# EAGLE design gpi-ctl (EAGLE 7.5.0)
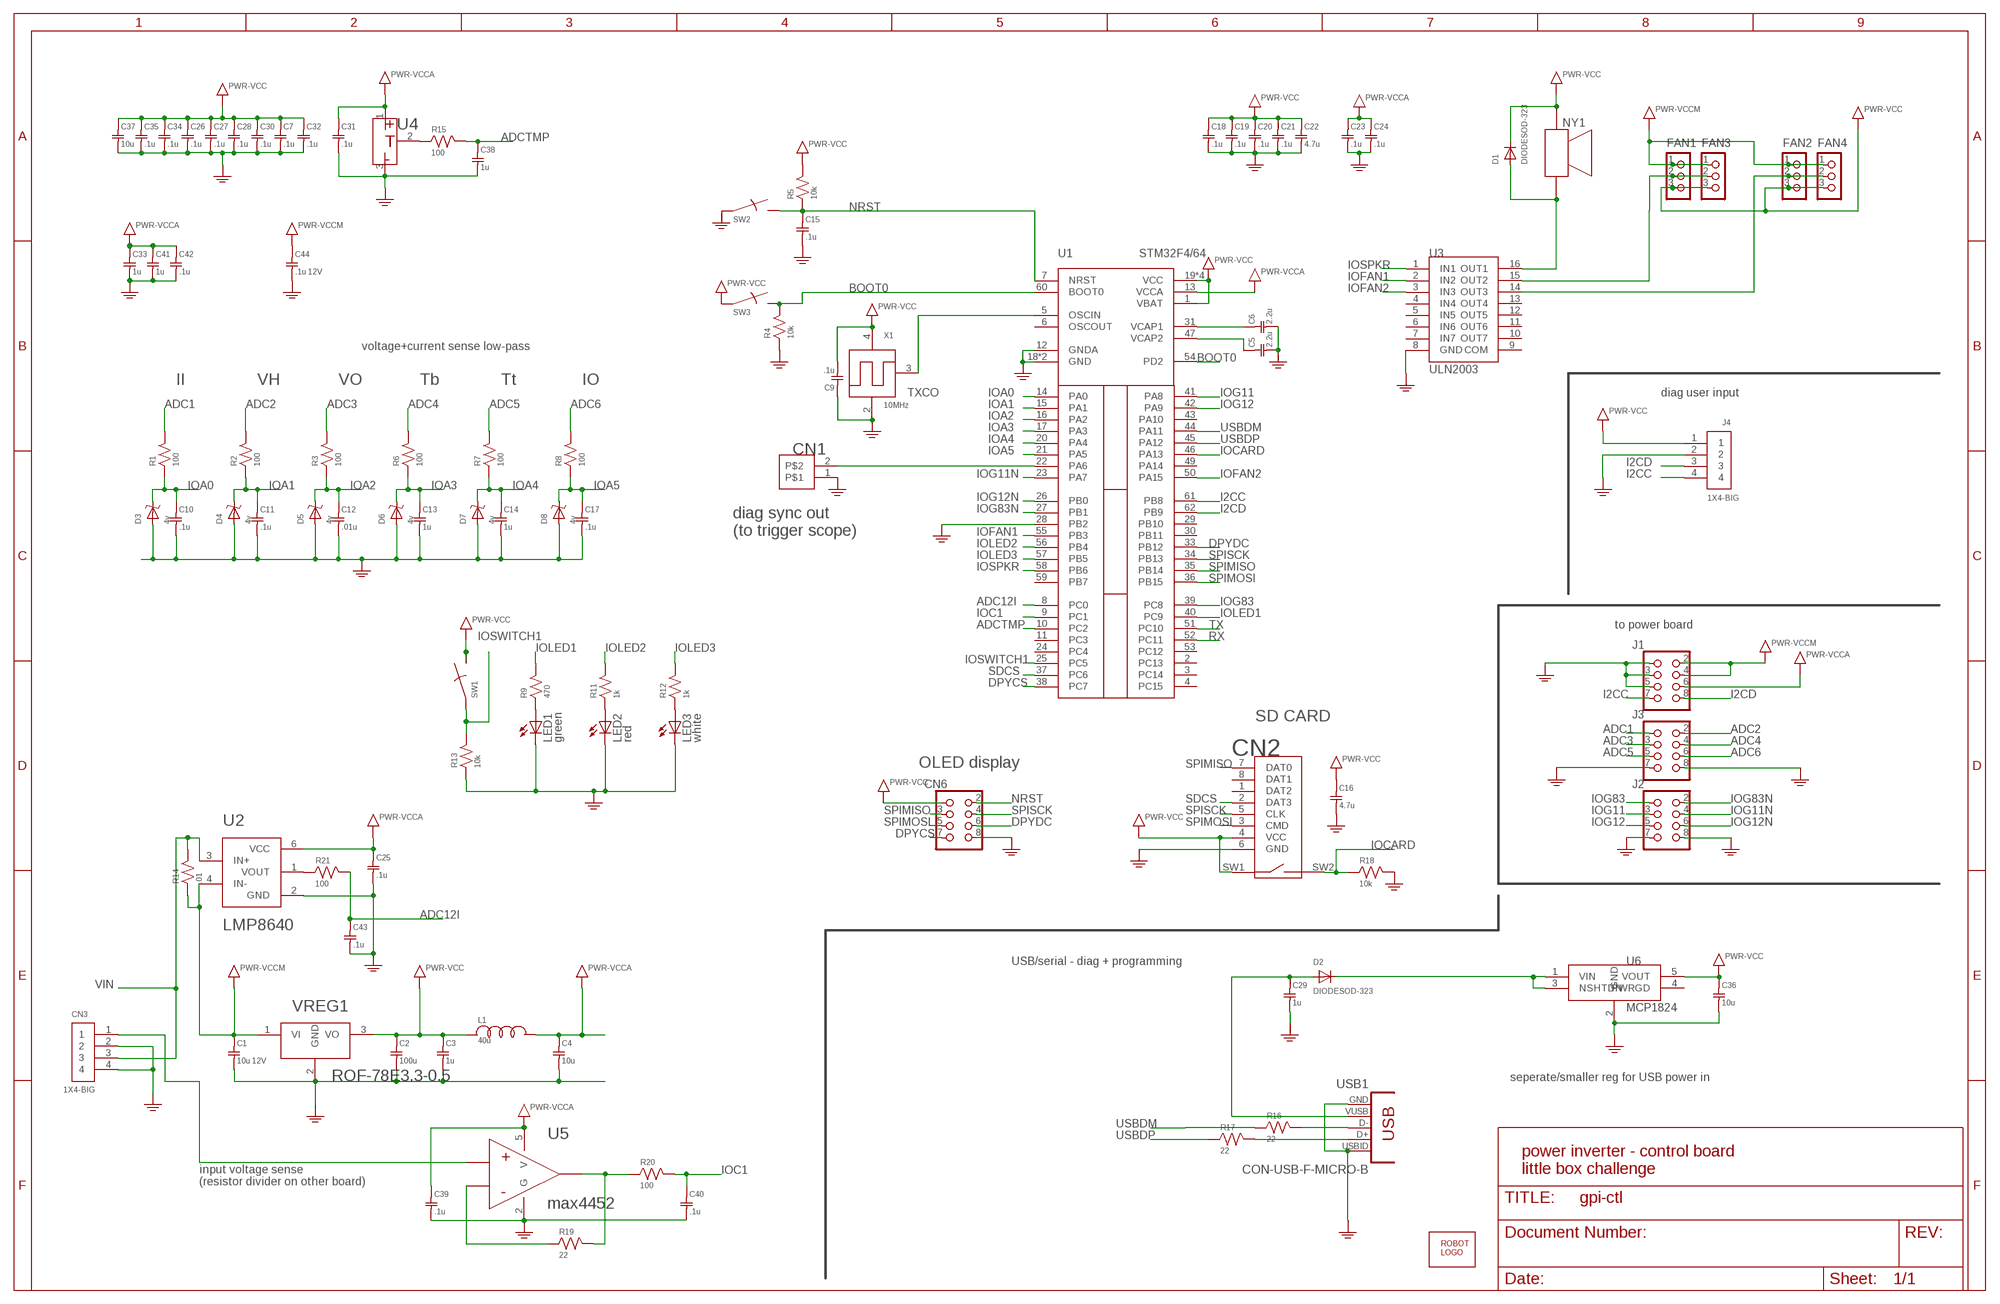
[diagram p0: schematic, sheet 1]

## Parts
C1  10u 12V  C0603  [SMD0603]
C2  100u  C1210  [SMD1210]
C3  1u  C0603  [SMD0603]
C4  10u  C0603  [SMD0603]
C5  2.2u  C0603  [SMD0603]
C6  2.2u  C0603  [SMD0603]
C7  .1u  C0603  [SMD0603]
C9  .1u  C0603  [SMD0603]
C10  .1u  C0603  [SMD0603]
C11  .1u  C0603  [SMD0603]
C12  .01u  C0603  [SMD0603]
C13  1u  C0603  [SMD0603]
C14  1u  C0603  [SMD0603]
C15  .1u  C0603  [SMD0603]
C16  4.7u  C0603  [SMD0603]
C17  .1u  C0603  [SMD0603]
C18  .1u  C0603  [SMD0603]
C19  .1u  C0603  [SMD0603]
C20  .1u  C0603  [SMD0603]
C21  .1u  C0603  [SMD0603]
C22  4.7u  C0603  [SMD0603]
C23  .1u  C0603  [SMD0603]
C24  .1u  C0603  [SMD0603]
C25  .1u  C0603  [SMD0603]
C26  .1u  C0603  [SMD0603]
C27  .1u  C0603  [SMD0603]
C28  .1u  C0603  [SMD0603]
C29  1u  C0603  [SMD0603]
C30  .1u  C0603  [SMD0603]
C31  .1u  C0603  [SMD0603]
C32  .1u  C0603  [SMD0603]
C33  1u  C0603  [SMD0603]
C34  .1u  C0603  [SMD0603]
C35  .1u  C0603  [SMD0603]
C36  10u  C0603  [SMD0603]
C37  10u  C0603  [SMD0603]
C38  1u  C0603  [SMD0603]
C39  .1u  C0603  [SMD0603]
C40  .1u  C0603  [SMD0603]
C41  1u  C0603  [SMD0603]
C42  .1u  C0603  [SMD0603]
C43  .1u  C0603  [SMD0603]
C44  .1u 12V  C0603  [SMD0603]
CN1  HEADER-1X2.4  [HEADER-1X2-THM-WIDE]
CN2  MICROSDPLAIN  [MICROSD/MOLEX/FRONT/PLAIN]
CN3  1X4-BIG  [1X04-BIG]
CN6  HEADER-2X4  [HEADER-2X04]
D1  DIODESOD-323  [SOD-323]
D2  DIODESOD-323  [SOD-323]
D3  4v  ZENER  [SOD-323]
D4  4v  ZENER  [SOD-323]
D5  4v  ZENER  [SOD-323]
D6  4v  ZENER  [SOD-323]
D7  4v  ZENER  [SOD-323]
D8  4v  ZENER  [SOD-323]
FAN1  CON_HEADER_1X03-PTH  [M1X3]
FAN2  CON_HEADER_1X03-PTH  [M1X3]
FAN3  CON_HEADER_1X03-PTH  [M1X3]
FAN4  CON_HEADER_1X03-PTH  [M1X3]
J1  HEADER-2X4  [HEADER-2X04]
J2  HEADER-2X4  [HEADER-2X04]
J3  HEADER-2X4  [HEADER-2X04]
J4  1X4-BIG  [1X04-BIG]
L1  40u  LSMD0603  [SMD0603]
LED1  green  LED3MM  [LED3MM]
LED2  red  LED3MM  [LED3MM]
LED3  white  LED3MM  [LED3MM]
NY1  PUI-5040  [PUI-0540]
R1  100  R0603  [SMD0603]
R2  100  R0603  [SMD0603]
R3  100  R0603  [SMD0603]
R4  10k  R0603  [SMD0603]
R5  10k  R0603  [SMD0603]
R6  100  R0603  [SMD0603]
R7  100  R0603  [SMD0603]
R8  100  R0603  [SMD0603]
R9  470  R0603  [SMD0603]
R11  1k  R0603  [SMD0603]
R12  1k  R0603  [SMD0603]
R13  10k  R0603  [SMD0603]
R14  .01  R0805  [SMD0805]
R15  100  R0603  [SMD0603]
R16  22  R0603  [SMD0603]
R17  22  R0603  [SMD0603]
R18  10k  R0603  [SMD0603]
R19  22  R0603  [SMD0603]
R20  100  R0603  [SMD0603]
R21  100  R0603  [SMD0603]
SW1  SWITCHGT12-THOLE  [SWITCH-GT12MCBE]
SW2  SWITCHKMR211  [KMR211]
SW3  SWITCHKMR211  [KMR211]
U1  STM32F4/64  [TQFP64]
U2  LMP8640  [SOT-6]
U3  ULN2003  [TSSOP-16]
U4  TEMPERATURE  [SOT-23]
U5  max4452  OPAMP  [SOT-23-5]
U6  MCP1824  [SOT-23-5]
U$1  ROBOTMAN-LOGO  [ROBOTMAN-LOGO]
USB1  CON-USB-F-MICRO-B  [CONN_USB_MICRO-B]
VREG1  ROF-78E3.3-0.5  REGULATORROF  [ROF7800]
X1  10MHz  OSC  [OSC-AST3TQ]

## Nets
ADC1: J3.1 R1.2
ADC2: J3.2 R2.2
ADC3: J3.3 R3.2
ADC4: J3.4 R6.2
ADC5: J3.5 R7.2
ADC6: J3.6 R8.2
ADC12I: C43.1 R21.2 U1.8(PC0)
ADCTMP: C38.1 R15.2 U1.10(PC2)
BOOT0: R4.2 SW3.2 SW3.4 U1.54(PD2) U1.60(BOOT0)
DPYCS: CN6.7 U1.38(PC7)
DPYDC: CN6.6 U1.33(PB12)
GND: C1.2 C2.2 C3.2 C4.2 C5.2 C6.2 C7.2 C9.1 C10.2 C11.2 C12.2 C13.2 C14.2 C15.2 C16.2 C17.2 C18.2 C19.2 C20.2 C21.2 C22.2 C23.2 C24.2 C25.2 C26.2 C27.2 C28.2 C29.2 C30.2 C31.2 C32.2 C33.2 C34.2 C35.2 C36.2 C37.2 C38.2 C39.2 C40.2 C41.2 C42.2 C43.2 C44.2 CN1.1 CN2.6(GND) CN3.2 CN3.4 CN6.8 D3.A D4.A D5.A D6.A D7.A D8.A J1.1 J1.3 J1.5 J2.7 J2.8 J3.7 J3.8 J4.2 LED1.K(C) LED2.K(C) LED3.K(C) R4.1 R13.1 R18.2 SW2.1 SW2.3 U1.12(GNDA) U1.18(GND) U1.28(PB2) U1.63(GND) U2.2(GND) U3.8(GND) U4.3(G) U5.2(G) U6.2(GND) USB1.P4(USBID) USB1.P5(GND) VREG1.2(GND) X1.2(GND) ; supply symbol labelled PWR-GND
I2CC: J1.7 J4.4 U1.61(PB8)
I2CD: J1.8 J4.3 U1.62(PB9)
IOA0: C10.1 D3.C R1.1 U1.14(PA0)
IOA1: C11.1 D4.C R2.1 U1.15(PA1)
IOA2: C12.1 D5.C R3.1 U1.16(PA2)
IOA3: C13.1 D6.C R6.1 U1.17(PA3)
IOA4: C14.1 D7.C R7.1 U1.20(PA4)
IOA5: C17.1 D8.C R8.1 U1.21(PA5)
IOC1: C40.1 R20.2 U1.9(PC1)
IOCARD: CN2.SW2 R18.1 U1.46(PA13)
IOFAN1: U1.55(PB3) U3.2(IN2)
IOFAN2: U1.50(PA15) U3.3(IN3)
IOG11: J2.3 U1.41(PA8)
IOG11N: J2.4 U1.23(PA7)
IOG12: J2.5 U1.42(PA9)
IOG12N: J2.6 U1.26(PB0)
IOG83: J2.1 U1.39(PC8)
IOG83N: J2.2 U1.27(PB1)
IOLED1: R9.2 U1.40(PC9)
IOLED2: R11.2 U1.56(PB4)
IOLED3: R12.2 U1.57(PB5)
IOSPKR: U1.58(PB6) U3.1(IN1)
IOSWITCH1: R13.2 SW1.1 U1.25(PC5)
N$1: FAN2.2 FAN4.2 U3.14(OUT3)
N$2: R17.2 USB1.P3(D+)
N$3: U1.5(OSCIN) X1.3(OSC)
N$4: R16.2 USB1.P2(D-)
N$6: FAN1.2 FAN3.2 U3.15(OUT2)
N$8: D2.C U6.1(VIN) U6.3(NSHTDN)
N$9: R15.1 U4.2(OUT)
N$10: R19.1 U5.4(INM)
N$11: R19.2 R20.1 U5.1(OUT)
N$12: CN1.2 U1.22(PA6)
N$13: CN3.1 U5.3(INP)
N$15: LED1.A R9.1
N$16: LED2.A R11.1
N$17: LED3.A R12.1
N$18: R21.1 U2.1(VOUT)
N$29: C6.1 U1.31(VCAP1)
N$39: C5.1 U1.47(VCAP2)
NRST: C15.1 CN6.2 R5.1 SW2.2 SW2.4 U1.7(NRST)
RX: U1.52(PC11)
SDCS: CN2.2(DAT3) U1.37(PC6)
SPIMISO: CN2.7(DAT0) CN6.3 U1.35(PB14)
SPIMOSI: CN2.3(CMD) CN6.5 U1.36(PB15)
SPISCK: CN2.5(CLK) CN6.4 U1.34(PB13)
SPKR: D1.A NY1.P2 U3.16(OUT1)
TX: U1.51(PC10)
USBDM: R16.1 U1.44(PA11)
USBDP: R17.1 U1.45(PA12)
VBUS: C29.1 D2.A USB1.P1(VUSB)
VCC: C2.1 C3.1 C7.1 C9.2 C16.1 C18.1 C19.1 C20.1 C21.1 C22.1 C26.1 C27.1 C28.1 C30.1 C32.1 C34.1 C35.1 C36.1 C37.1 CN2.4(VCC) CN2.SW1 CN6.1 D1.C FAN1.3 FAN2.3 FAN3.3 FAN4.3 J4.1 L1.1 NY1.P1 R5.2 SW1.3 SW3.1 SW3.3 U1.1(VBAT) U1.19(VCC) U1.32(VCC) U1.48(VCC) U1.64(VCC) U6.5(VOUT) VREG1.3(VO) X1.4(VCC) ; supply symbol labelled PWR-VCC
VCCA: C4.1 C23.1 C24.1 C25.1 C31.1 C33.1 C39.1 C41.1 C42.1 J1.6 L1.2 U1.13(VCCA) U2.6(VCC) U4.1(V) U5.5(V) ; supply symbol labelled PWR-VCCA
VCCM: C1.1 C44.1 FAN1.1 FAN2.1 FAN3.1 FAN4.1 J1.2 J1.4 R14.1 U2.4(IN-) VREG1.1(VI) ; supply symbol labelled PWR-VCCM
VIN: CN3.3 R14.2 U2.3(IN+)
Unconnected: CN2.1(DAT2) CN2.8(DAT1) U1.2(PC13) U1.3(PC14) U1.4(PC15) U1.6(OSCOUT) U1.11(PC3) U1.24(PC4) U1.29(PB10) U1.30(PB11) U1.43(PA10) U1.49(PA14) U1.53(PC12) U1.59(PB7) U3.4(IN4) U3.5(IN5) U3.6(IN6) U3.7(IN7) U3.9(COM) U3.10(OUT7) U3.11(OUT6) U3.12(OUT5) U3.13(OUT4) U6.4(PWRGD) USB1.BODY@1(BODY) USB1.BODY@2(BODY) USB1.BODY@3(BODY) USB1.BODY@4(BODY)

## Notes on the sheet
- voltage+current sense low-pass
- II | VH | VO | Tb | Tt | IO
- TXCO | diag user input
- diag sync out
  (to trigger scope)
- to power board
- SD CARD
- OLED display
- USB/serial - diag + programming
- seperate/smaller reg for USB power in
- power inverter - control board
  little box challenge
- input voltage sense
  (resistor divider on other board)

## Library data of the parts
C1-C7 C9-C44 = jaw:C
CN1 = jaw:HEADER-1X2
CN2 = jaw:MICROSD
CN3 J4 = adafruit:1X4: 4-pin connector
CN6 J1-J3 = jaw:HEADER-2X4: PIN HEADER
D1 D2 = jaw:DIODE
D3-D8 = jaw:ZENER
FAN1-FAN4 = dp_devices:CON_HEADER_1X03
L1 = jaw:L
LED1-LED3 = adafruit:LED: LED OSRAM: - CHIPLED LG R971, LG N971, LY N971, LG Q971, LY Q971, LO R971, LY R971 LH N974, LH R974 LS Q976, LO Q976, LY Q976 LO Q996 - Hyper CHIPLED LW Q18S LB Q993, LB Q99A, LB R99A - SideLED LS A670, LO A670, LY A670, LG A670, LP A670 LB A673, LV A673, LT A673, LW A673 LH A674 LY A675 LS A676, LA A676, LO A676, LY A676, LW A676 LS A679, LY A679, LG A679 - Hyper Micro SIDELED® LS Y876, LA Y876, LO Y876, LY Y876 LT Y87S - SmartLED LW L88C, LW L88S LB L89C, LB L89S, LG L890 LS L89K, LO L89K, LY L89K LS L896, LA L896, LO L896, LY L896 - TOPLED LS T670, LO T670, LY T670, LG T670, LP T670 LSG T670, LSP T670, LSY T670, LOP T670, LYG T670 LG T671, LOG T671, LSG T671 LB T673, LV T673, LT T673, LW T673 LH T674 LS T676, LA T676, LO T676, LY T676, LB T676, LH T676, LSB T676, LW T676 LB T67C, LV T67C, LT T67C, LS T67K, LO T67K, LY T67K, LW E67C LS E67B, LA E67B, LO E67B, LY E67B, LB E67C, LV E67C, LT E67C LW T67C LS T679, LY T679, LG T679 LS T770, LO T770, LY T770, LG T770, LP T770 LB T773, LV T773, LT T773, LW T773 LH T774 LS E675, LA E675, LY E675, LS T675 LS T776, LA T776, LO T776, LY T776, LB T776 LHGB T686 LT T68C, LB T68C - Hyper Mini TOPLED® LB M676 - Mini TOPLED Santana® LG M470 LS M47K, LO M47K, LY M47K Source: http://www.osram.convergy.de/
NY1 = jaw:PUI-5040
R1-R9 R11-R21 = jaw:R
SW1-SW3 = jaw:SWITCH
U1 = jaw:STM32F4/64
U2 = jaw:LMP8640
U3 = jaw:ULN2003
U4 = jaw:TEMPERATURE
U5 = jaw:OPAMP
U6 = jaw:MCP1824
U$1 = jaw:ROBOTMAN-LOGO
USB1 = dp_devices:CON-USB-F: USB Female connector
VREG1 = jaw:REGULATOR
X1 = jaw:OSC

## Board
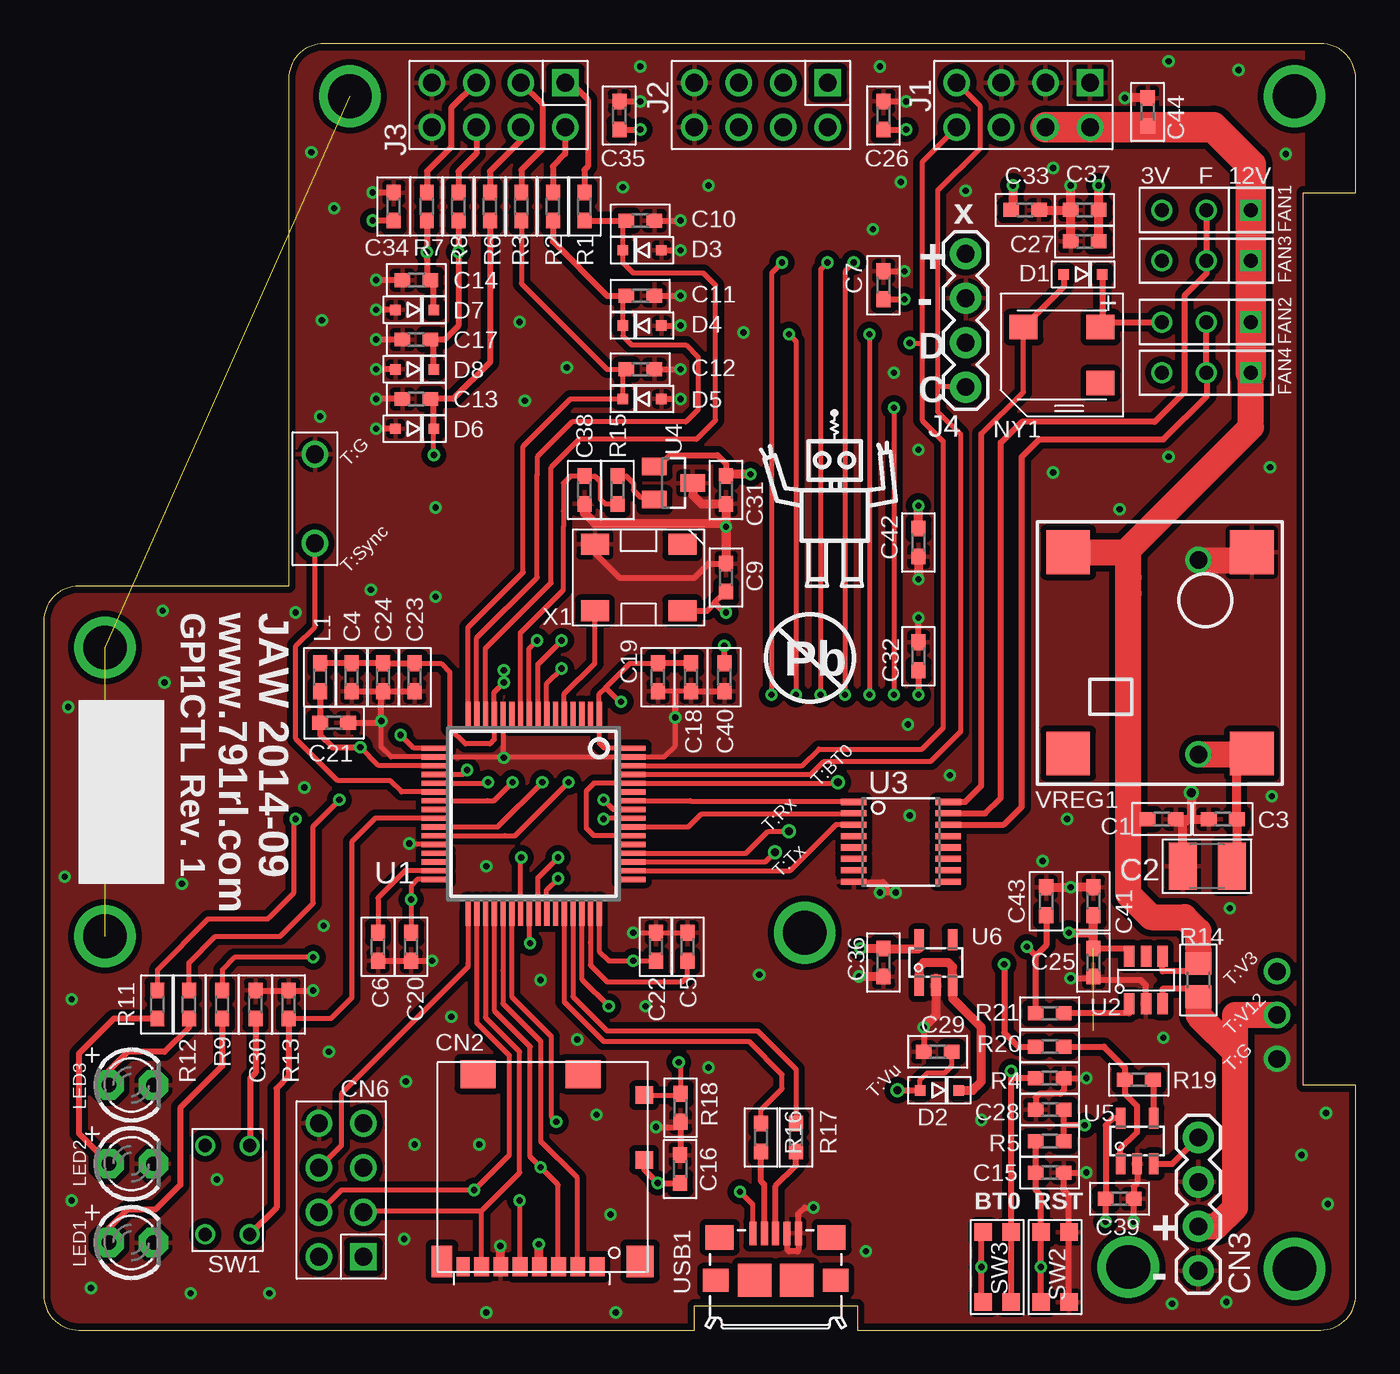
[diagram p1: board, top side]
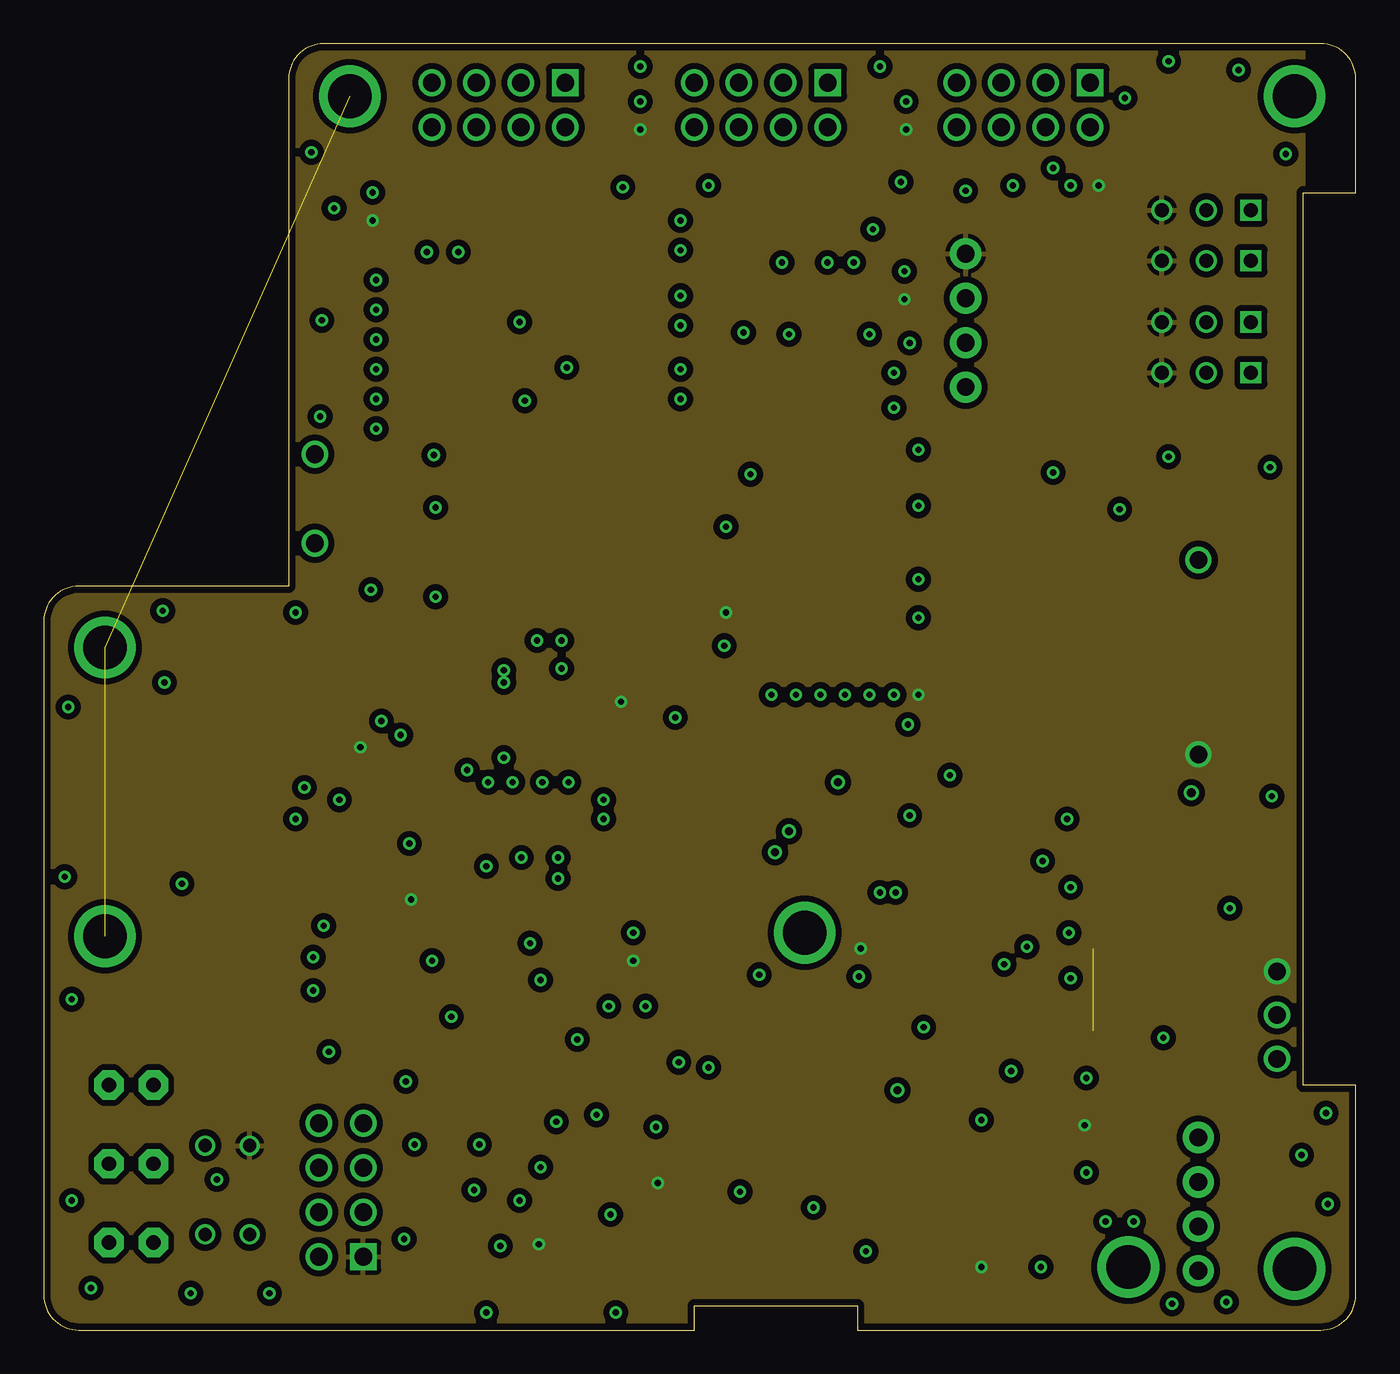
[diagram p2: board, inner layer power]
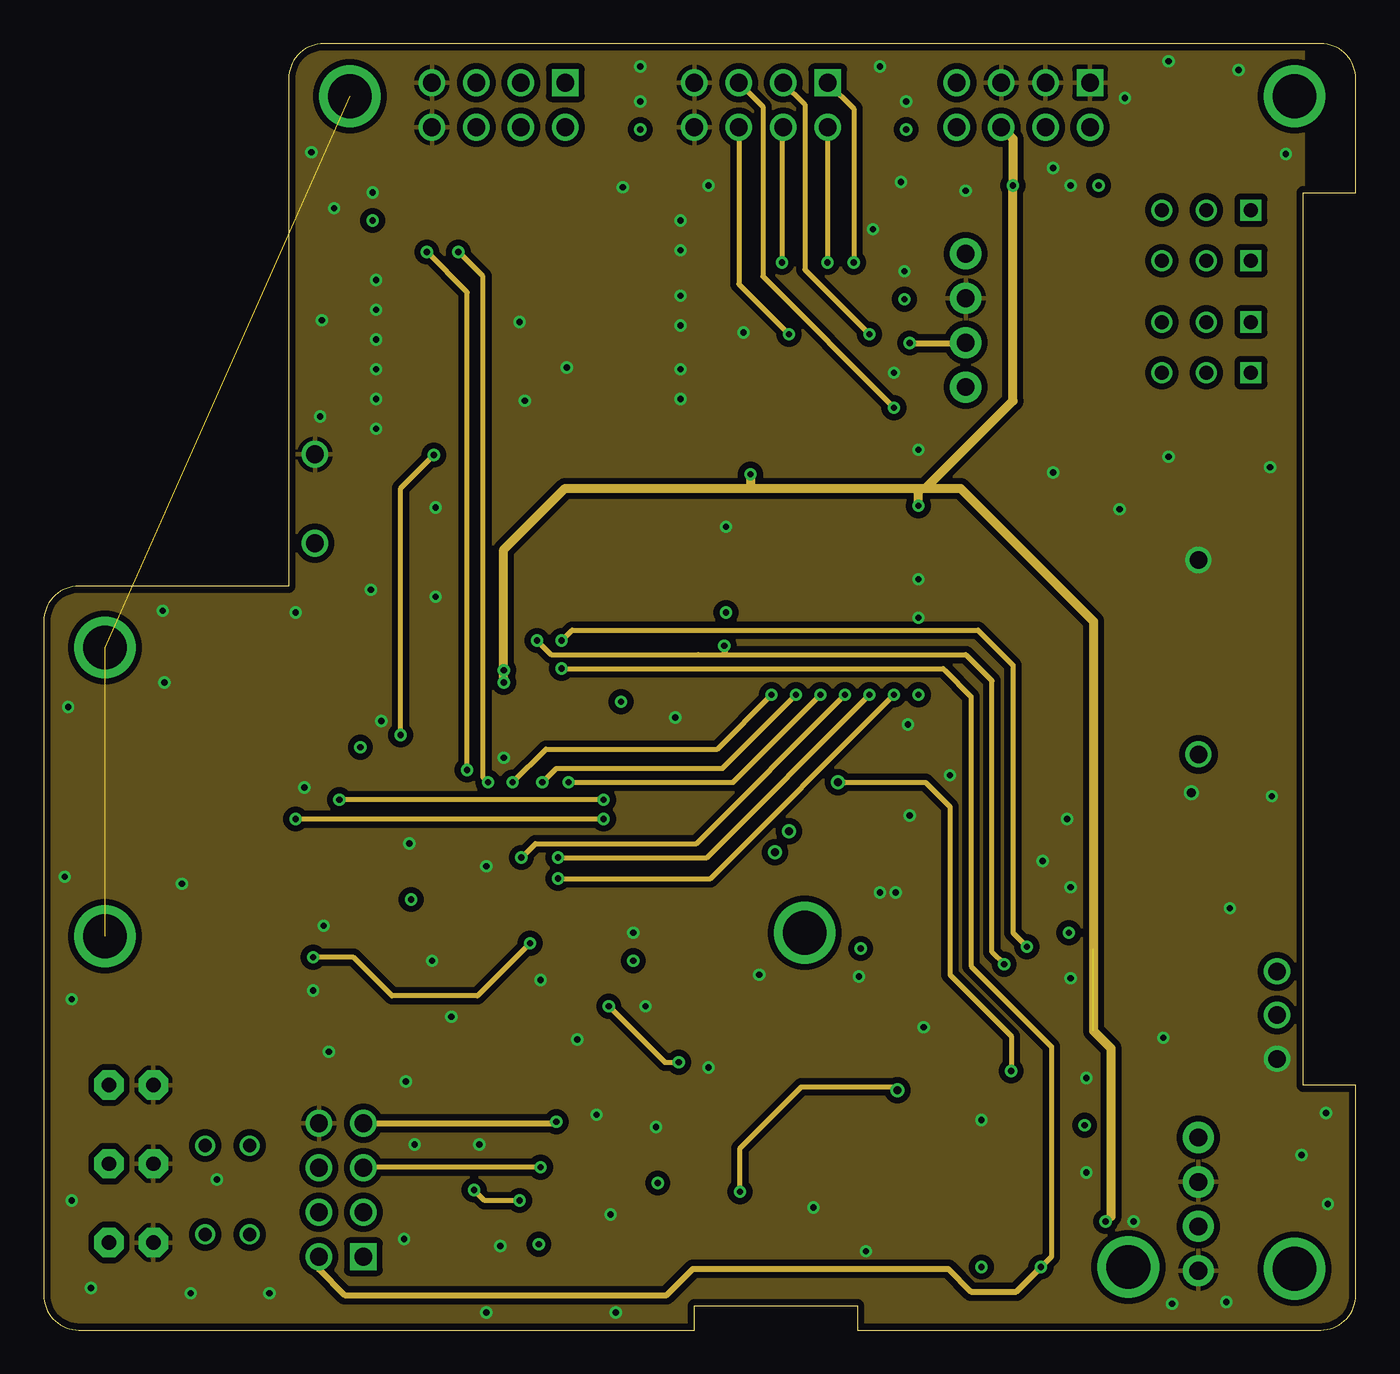
[diagram p3: board, inner layer signal]
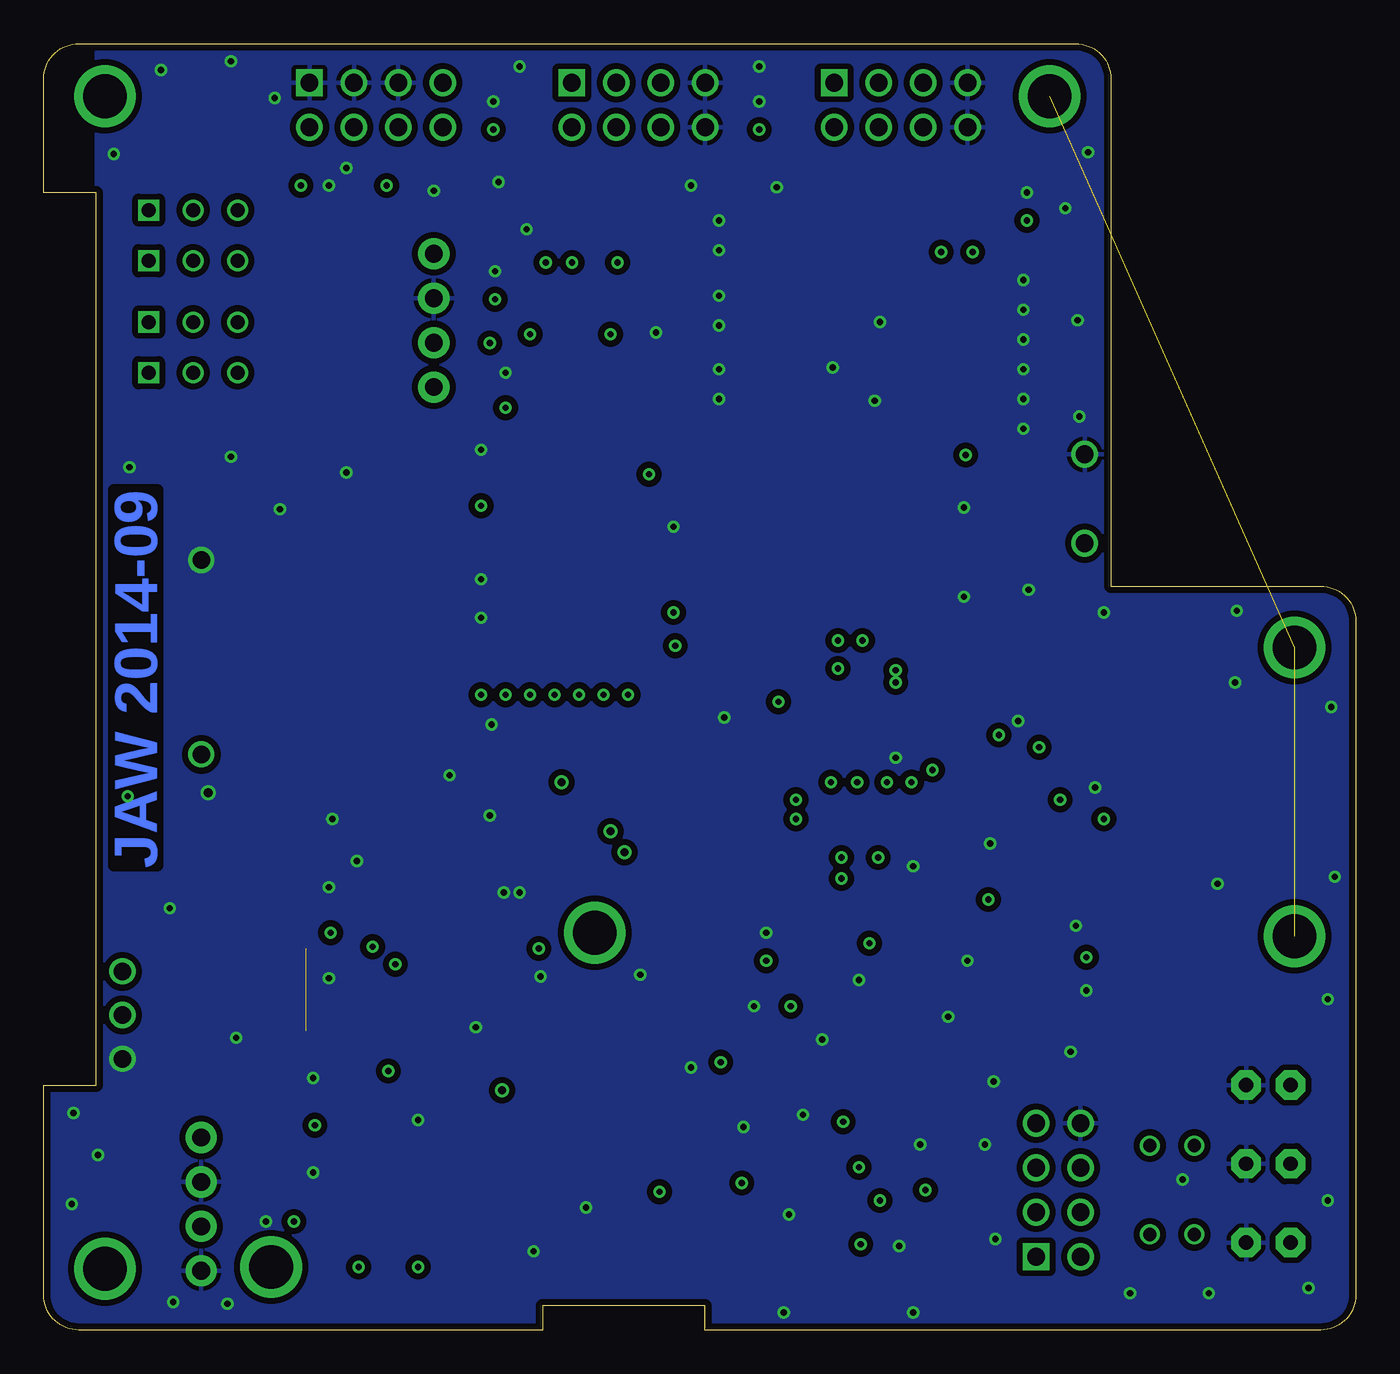
[diagram p4: board, bottom side, seen from below]

Size 75 x 73.5 mm. Coordinates in mm from the lower left corner, seen from the top.
Outline: 0,40.5 0,2 arc90 2,0 37.2,0 37.2,1.4 46.5,1.4 46.5,0 73,0 arc90 75,2 75,14 72,14 72,65 75,65 75,71.5 arc90 73,73.5 16,73.5 arc90 14,71.5 14,42.5 2,42.5 arc90 0,40.5
Copper layers (1*2*15*16): Top 0.0356mm / dielectric 1.5011mm / power 0.0356mm / dielectric 0.1499mm / signal 0.0356mm / dielectric 0.2007mm / Bottom 0.0356mm
Design rules "LaenPCBOrder *": minimum track width 6mil, minimum drill 13mil, track to track 6mil, track to pad 6mil, pad to pad 6mil, via to via 6mil, smd to smd 6mil, copper to edge 15mil, drill to drill 6mil, minimum pad ring 7mil, minimum via ring 7mil, stop-mask expansion 4mil, vias tented up to drill 0.4mm, thermal gap 10mil

### Footprints (pad centres in the part's own frame; a part is rotated, then mirrored left to right if it is on the bottom)
SMD0603 = smd 0.9 x 0.8: 1 -0.8,0; 2 0.8,0
SMD1210 = smd 1.6 x 2.7: 1 -1.4,0; 2 1.4,0
HEADER-1X2-THM-WIDE = drill 1.016: 1 -2.54,0; 2 2.54,0
MICROSD/MOLEX/FRONT/PLAIN = smd 0.85 x 1.1: 1 3.105,-4.43; 2 2.005,-4.43; 3 0.905,-4.43; 4 -0.195,-4.43; 5 -1.295,-4.43; 6 -2.395,-4.43; 7 -3.495,-4.43 | smd 0.75 x 1.1: 8 -4.545,-4.43 | smd 1.17 x 1.8: P$1 -5.755,-4.13 | smd 1.55 x 1.8: P$2 5.565,-4.13 | smd 2 x 1.6: P$3 -3.7,6.57; P$4 2.3,6.57 | smd 1 x 1: SW1 5.8,1.67; SW2 5.8,5.37
1X04-BIG = drill 1.016 pad 1.778: 1 0,0; 2 2.54,0; 3 5.08,0; 4 7.62,0
HEADER-2X04 = drill 1.016 square: 1 -3.81,-1.27 | drill 1.016: 2 -3.81,1.27; 3 -1.27,-1.27; 4 -1.27,1.27; 5 1.27,-1.27; 6 1.27,1.27; 7 3.81,-1.27; 8 3.81,1.27
SOD-323 = smd 0.6 x 0.6: A 1.1,0; C -1.1,0
M1X3 = drill 0.8 square: 1 0,0 | drill 0.8: 2 2.54,0; 3 5.08,0
LED3MM = drill 0.813 pad 1.676 octagon: A -1.27,0; K 1.27,0
PUI-0540 = smd 1.4 x 1.6: NC 1.6,2.2; P1 -1.6,2.2; P2 -1.6,-2.2
SMD0805 = smd 1.3 x 1.5: 1 -0.95,0; 2 0.95,0
SWITCH-GT12MCBE = drill 0.762: 1 1.27,-2.54; 3 1.27,2.54; 4 -1.27,-2.54; 6 -1.27,2.54
KMR211 = smd 1 x 1: 1 -2,0.8; 2 -2,-0.8; 3 2,0.8; 4 2,-0.8
TQFP64 = smd 0.3 x 1.6: 1 -3.75,-5.6; 2 -3.25,-5.6; 3 -2.75,-5.6; 4 -2.25,-5.6; 5 -1.75,-5.6; 6 -1.25,-5.6; 7 -0.75,-5.6; 8 -0.25,-5.6; 9 0.25,-5.6; 10 0.75,-5.6; 11 1.25,-5.6; 12 1.75,-5.6; 13 2.25,-5.6; 14 2.75,-5.6; 15 3.25,-5.6; 16 3.75,-5.6; 33 3.75,5.6; 34 3.25,5.6; 35 2.75,5.6; 36 2.25,5.6; 37 1.75,5.6; 38 1.25,5.6; 39 0.75,5.6; 40 0.25,5.6; 41 -0.25,5.6; 42 -0.75,5.6; 43 -1.25,5.6; 44 -1.75,5.6; 45 -2.25,5.6; 46 -2.75,5.6; 47 -3.25,5.6; 48 -3.75,5.6 | smd 1.6 x 0.3: 17 5.6,-3.75; 18 5.6,-3.25; 19 5.6,-2.75; 20 5.6,-2.25; 21 5.6,-1.75; 22 5.6,-1.25; 23 5.6,-0.75; 24 5.6,-0.25; 25 5.6,0.25; 26 5.6,0.75; 27 5.6,1.25; 28 5.6,1.75; 29 5.6,2.25; 30 5.6,2.75; 31 5.6,3.25; 32 5.6,3.75; 49 -5.6,3.75; 50 -5.6,3.25; 51 -5.6,2.75; 52 -5.6,2.25; 53 -5.6,1.75; 54 -5.6,1.25; 55 -5.6,0.75; 56 -5.6,0.25; 57 -5.6,-0.25; 58 -5.6,-0.75; 59 -5.6,-1.25; 60 -5.6,-1.75; 61 -5.6,-2.25; 62 -5.6,-2.75; 63 -5.6,-3.25; 64 -5.6,-3.75
SOT-6 = smd 0.6 x 1.2: 1 -0.95,-1.35; 2 0,-1.35; 3 0.95,-1.35; 4 0.95,1.35; 5 0,1.35; 6 -0.95,1.35
TSSOP-16 = smd 0.35 x 1.43: 1 -2.275,-2.7; 2 -1.625,-2.7; 3 -0.975,-2.7; 4 -0.325,-2.7; 5 0.325,-2.7; 6 0.975,-2.7; 7 1.625,-2.7; 8 2.275,-2.7; 9 2.275,2.7; 10 1.625,2.7; 11 0.975,2.7; 12 0.325,2.7; 13 -0.325,2.7; 14 -0.975,2.7; 15 -1.625,2.7; 16 -2.275,2.7
SOT-23 = smd 1 x 1.4: 1 -0.95,-1.1; 2 0.95,-1.1; 3 0,1.1
SOT-23-5 = smd 0.55 x 1.2: 1 -0.95,-1.3; 2 0,-1.3; 3 0.95,-1.3; 4 0.95,1.3; 5 -0.95,1.3
CONN_USB_MICRO-B = smd 1.6 x 1.4: BODY@1 -3.2,2.45; BODY@2 3.2,2.45 | smd 1.45 x 1.3: BODY@3 3.425,0; BODY@6 -3.425,0 | smd 1.9 x 1.9: BODY@4 1.2,0; BODY@5 -1.2,0 | smd 0.4 x 1.35: P1 -1.3,2.675; P2 -0.65,2.675; P3 0,2.675; P4 0.65,2.675; P5 1.3,2.675
ROF7800 = smd 2.5 x 2.5: 1 -5.25,5.75; 2 5.25,5.75; 3 5.25,-5.75; 4 -5.25,-5.75
OSC-AST3TQ = smd 1.6 x 1.2: 1 -2.5,-1.9; 2 2.5,-1.9; 3 2.5,1.9; 4 -2.5,1.9

### Placement (x,y rotation side)
C1  63.9,29.2 0 top
C2  66.5,26.5 180 top
C3  67.4,29.2 180 top
C4  17.6,37.3 270 top
C5  36.8,21.9 90 top
C6  19.1,21.9 270 top
C7  48,59.7 90 top
C9  39,43 270 top
C10  34.1,63.4 0 top
C11  34.1,59.1 0 top
C12  34.1,54.9 0 top
C13  21.3,53.2 180 top
C14  21.3,60 180 top
C15  57.5,9 0 top
C16  36.38,9.2 90 top
C17  21.3,56.6 180 top
C18  37,37.3 270 top
C19  35.1,37.3 270 top
C20  21,21.9 270 top
C21  16.6,34.7 0 top
C22  35,21.9 90 top
C23  21.2,37.3 270 top
C24  19.4,37.3 270 top
C25  60,21 270 top
C26  48,69.4 90 top
C27  59.5,62.2 180 top
C28  57.5,12.6 180 top
C29  51.1,15.9 180 top
C30  12.1,18.6 90 top
C31  39,48 270 top
C32  50,38.5 90 top
C33  56.1,64 0 top
C34  20,64.2 90 top
C35  32.9,69.4 90 top
C36  48,21 270 top
C37  59.5,64 180 top
C38  30.9,48 270 top
C39  61.5,7.5 0 top
C40  38.9,37.3 270 top
C41  60,24.5 90 top
C42  50,45 270 top
C43  57.3,24.5 90 top
C44  63.1,69.6 90 top
CN1  15.5,47.5 270 top
CN2  28.52,8.05 0 top
CN3  66,11 270 top
CN6  17,8 90 top
D1  59.41,60.32 180 top
D2  51.2,13.7 180 top
D3  34.2,61.7 0 top
D4  34.2,57.4 0 top
D5  34.2,53.2 0 top
D6  21.2,51.5 180 top
D7  21.2,58.3 180 top
D8  21.2,54.9 180 top
FAN1  69,64 180 top
FAN2  69,57.6 180 top
FAN3  69,61.1 180 top
FAN4  69,54.7 180 top
J1  56,70 180 top
J2  41,70 180 top
J3  26,70 180 top
J4  52.7,61.5 270 top
L1  15.8,37.3 90 top
LED1  5,5 0 top
LED2  5,9.5 0 top
LED3  5,14 0 top
NY1  58.2,55.71 270 top
R1  30.9,64.2 90 top
R2  29.1,64.2 90 top
R3  27.3,64.2 90 top
R4  57.5,14.4 180 top
R5  57.5,10.8 0 top
R6  25.5,64.2 90 top
R7  21.9,64.2 90 top
R8  23.7,64.2 90 top
R9  10.2,18.6 90 top
R11  6.5,18.6 90 top
R12  8.3,18.6 90 top
R13  14,18.6 270 top
R14  66,20 270 top
R15  32.8,48 270 top
R16  41,11 270 top
R17  43,11 270 top
R18  36.4,12.7 270 top
R19  62.6,14.3 180 top
R20  57.5,16.2 180 top
R21  57.5,18.1 180 top
SW1  10.5,8 0 top
SW2  57.8,3.6 270 top
SW3  54.5,3.6 90 top
U1  28,29.5 180 top
U2  63,20 0 top
U3  49,27.9 270 top
U4  36,48.4 270 top
U5  62.5,10.8 0 top
U6  51,21 0 top
U$1  45.2,46.8 0 top
USB1  41.84,2.84 0 top
VREG1  63.8,38.7 0 top
X1  34,43 180 top

### Tracks (layer width: path | path; a pad name or v marks a point on that pad's centre or on a via)
ADC1
  Top 0.35: J3.1 30.13,71.27 31.1,70.3 31.1,66.5 30.9,66.3 R1.2 31.1,65.2
ADC2
  Top 0.35: J3.2 29.81,67.21 29.1,66.5 R2.2
ADC3
  Top 0.35: J3.3 28.5,70.04 28.5,67.5 27.3,66.3 R3.2
ADC4
  Top 0.35: J3.4 27.27,67.97 25.5,66.2 R6.2
ADC5
  Top 0.35: J3.5 23.3,69.84 23.3,67.6 21.9,66.2 R7.2
ADC6
  Top 0.35: J3.6 24.73,67.23 23.7,66.2 R8.2
ADC12I  (via drill 0.35)
  Top 0.3: U1.8 28.25,38.05 v29.6,39.4
  Top 0.35: R21.2 56.7,21.4 | 56.7,21.4 v56.2,21.9 | C43.1 57.3,22 56.7,21.4
  signal 0.3: v29.6,39.4 30.2,40 53.4,40 55.4,38 55.4,22.7 v56.2,21.9
ADCTMP
  Top 0.3: U1.10 27.25,39.85 29.7,42.3 29.7,45.9 29.7,46.8 29.7,48.4 30.1,48.8 C38.1 31.5,48.8 31.8,48.5 31.8,47.5 32.1,47.2 R15.2
BOOT0  (via drill 0.35, 0.45)
  Top 0.3: U1.54 31.45,28.25 31,28.7 31,30.8 31.45,31.25 U1.60 45.35,31.25 v45.4,31.3
  Top 0.35: SW3.2 SW3.4 55.3,14.4 | 55.3,14.4 v55.3,14.8 | R4.2 55.3,14.4
  signal 0.3: v45.4,31.3 50.4,31.3 51.8,29.9 51.8,20.3 55.3,16.8 v55.3,14.8
DPYCS  (via drill 0.35)
  Top 0.3: U1.38 26.75,19.05 29,16.8 29,12.2 v29.3,11.9 29.21,11.81
  signal 0.3: v29.3,11.9 29.26,11.86
  signal 0.35: CN6.7 29.21,11.81 v29.3,11.9
DPYDC
  Top 0.3: U1.33 24.25,20.95 24.25,20.75 17,13.5 17,10.54 CN6.6
GND  (via drill 0.35, 0.5, 1)
  Top 0.3: v19.3,34.8 19.3,33.3 19.85,32.75 U1.18 26.2,32.75 | C18.2 36.1,36.5 C19.2 | v36.1,35 36.1,33.4 35.45,32.75 U1.63 26.2,32.75 | U1.12 26.25,32.8 26.2,32.75 | C6.2 C20.2 | U1.28 20.85,27.75 v20.9,27.8 | X1.2 31.5,44.4 | 39,46 v39,45.9 39,46.1 | U3.8 47.98,25.62 48.2,25.4 48.2,25 | C5.2 C22.2 v33.7,22.7 | v47.8,25 48.2,25 | 48.2,25 v48.7,25
  Top 0.35: C24.2 19.4,36.6 19.3,36.5 | C24.2 C23.2 | v36.1,35 36.1,36.5 | 31.5,44.4 32.9,43 37.2,43 38,43.8 C9.1 | 26.12,4.78 v26.1,4.8 | C16.2 36.4,10.02 R18.2 36.1,11.6 v35,11.6 | SW2.3 SW2.1 58.6,7.7 58.3,8 C15.2 v59.6,9 | v44,7 43.5,7 43.14,6.64 USB1.P5 43.14,4.54 43.1,4.5 42.6,4.5 42.49,4.61 USB1.P4 | v50.3,17.3 C29.2 | C6.2 v22.2,21.1 | C30.2 R13.1 v15.4,19.4 | C32.2 v50,40.7 | C7.2 v49.2,60.5 | 19.3,36.5 v19.3,34.8 19.2,34.7 C21.2 | C10.2 v36.4,63.4 | C11.2 v36.4,59.1 | C12.2 v36.4,54.9 | D5.A v36.4,53.2 | D4.A v36.4,57.4 | D3.A v36.4,61.7 | D6.A v19,51.5 | C13.2 v19,53.2 | D8.A v19,54.9 | C17.2 v19,56.6 | D7.A v19,58.3 | C14.2 v19,60 | C34.2 v18.8,65 | C35.2 v34.1,70.2 | C26.2 v49.3,70.2 | C4.2 C24.2 | C24.2 19.3,36.5 | v59.6,14.4 R4.1 58.3,13.7 58.1,13.5 56.9,13.5 56.7,13.3 C28.2 | v62.3,6.2 C39.2 62.3,8.2 62.5,8.4 U5.2 | C18.2 C40.2 | U2.2 63,19.7 62.7,20 60.2,20 C25.2 59.9,20.1 v58.7,20.1 | C43.2 57.5,25.3
  Top 0.5: 39,46.1 C31.2 37.6,47.2 37.1,47.7 U4.3 | 39,46.1 39,46 | v39,45.9 C9.1 | CN2.6 26.12,4.78 | C1.2 65.4,29.2 | 65.4,29.2 65.6,29.2 | 65.6,29.2 C3.2 | C2.2 65.1,28.9 65.4,29.2 | v65.6,30.7 65.6,29.2 | C27.2 C37.2 | C37.2 v58.7,65.4 | C36.2 v46.6,20.2 | 39,46.1 31.5,46.1 30.9,46.7 C38.2 | C33.2 C37.2 | C41.2 58.8,25.3 v58.7,25.3 58.6,25.3 57.5,25.3 | C42.2 v50,42.9 | C44.2 v61.8,70.4 | U6.2 51,18 v50.3,17.3
  Top 1.5: v66,44 68.6,44 VREG1.2
  other vias: 26.3,32.7 25.3,26.5 6.9,37 1.4,35.6 1.2,25.9 7.9,25.5 1.6,18.9 14.9,31 18.7,42.3 22.4,41.9 22.4,47 27.5,53.1 28.4,20 34.4,18.5 30.5,16.6 23.3,17.9 16.3,15.9 20.7,14.2 21.2,10.6 12.9,2.1 8.4,2.1 9.9,8.6 1.6,7.4 32.4,6.6 38,15 40.9,20.3 49.5,29.4 53.6,12 57.1,26.8 71.9,10 73.3,12.4 48.6,54.7 49,65.6 47.4,62.9 33.1,65.3 38,65.4 15.3,67.3 68.3,72 71,67.2 57.7,66.4 52.7,65.1 40,57 29.9,55 27.2,57.6 67.6,1.6 6.8,41.1 14.4,41 16,23.1 49.4,34.6 51.8,31.7 24.9,10.6 20.6,5.2 31.6,12.3 73.4,7.2 15.8,52.2 16.6,64.1 15.9,57.7 70.5,15.5 64.3,49.9 61.5,46.9 70.1,49.3 57.7,49 50,50.3 58.5,29.2 67.8,24.1 64,16.7 2.7,2.4 25.3,1 47,4.5 32.7,1 64.5,1.5 34.1,72.2 47.8,72.2 64.3,72.5 70.2,30.5
  pour signal (isolate 0.35): -0.9,-0.9 77,-1 77,64 72,64 72,74 -0.9,74
  pour Bottom (isolate 0.35): -0.9,-0.9 77,-1 77.1,64 72,64 72,74 -0.9,74
  pour Top (isolate 0.35): -0.9,-0.9 77,-1 77,64 72,64 72,74 -0.9,74
I2CC
  Top 0.3: U1.61 43.85,31.75 44.6,32.5 50.7,32.5 52.4,34.2 52.4,51.2 51.1,52.5 51.1,53.9 | J1.7 53.5,69.96 53.5,67.5 51.1,65.1 51.1,53.9 | J4.4 52.68,53.9 51.1,53.9
I2CD  (via drill 0.35)
  Top 0.3: U1.62 43.35,32.25 44.3,33.2 50.2,33.2 51.4,34.4 51.4,50.8 50.2,52 50.2,56.4 | J1.8 51.4,67.94 50.2,66.74 50.2,56.4 | v49.5,56.4 50.2,56.4
  signal 0.35: v49.5,56.4 52.68,56.4 J4.3
IOA0
  Top 0.3: C10.1 33.1,63.2 D3.C 33.1,61 33.7,60.4 37.7,60.4 38.4,59.7 38.4,52 37.3,50.9 30.6,50.9 29,49.3 29,42.7 25.25,38.95 U1.14
  Top 0.35: R1.1 C10.1
IOA1
  Top 0.3: C11.1 33.1,58.9 D4.C 33.1,56.8 33.6,56.3 36.7,56.3 37.4,55.6 37.4,52.6 36.7,51.9 30.2,51.9 28.2,49.9 28.2,48.9 28.2,43 24.75,39.55 U1.15
  Top 0.35: R2.1 29.1,62.2 32.2,59.1 C11.1
IOA2
  Top 0.3: U1.16 24.25,40.15 27.4,43.3 27.4,50.5 30.1,53.2 D5.C 33.1,54.7 C12.1 32.2,54.9 27.3,59.8 R3.1
IOA3  (via drill 0.35)
  Top 0.3: U1.17 21.15,33.25 v20.4,34 | v22.3,50 D6.C
  Top 0.35: R6.1 25.5,55.3 23.4,53.2 C13.1 22.3,53 D6.C
  signal 0.3: v20.4,34 20.4,48.1 v22.3,50
IOA4  (via drill 0.35)
  Top 0.3: U1.20 23.95,31.75 v24.2,32 | v21.9,61.6 21.9,61.2
  Top 0.35: R7.1 v21.9,61.6 21.9,61.2 21.9,60.2 C14.1 22.3,59.8 D7.C
  signal 0.3: v24.2,32 24.2,59.3 v21.9,61.6
IOA5  (via drill 0.35)
  Top 0.3: U1.21 25.35,31.25 v25.4,31.3
  Top 0.35: R8.1 v23.7,61.6 23.7,57.4 22.9,56.6 C17.1 22.3,56.4 D8.C
  signal 0.3: v25.4,31.3 25.1,31.6 25.1,60.2 v23.7,61.6
IOC1  (via drill 0.35)
  Top 0.3: U1.9 27.75,38.95 v28.2,39.4
  Top 0.35: v54.9,20.9 54.9,17 55.7,16.2 R20.2 | C40.1 v38.9,39.1
  signal 0.3: v28.2,39.4 29,38.6 37.4,38.6 38.9,38.6 52.7,38.6 54.2,37.1 54.2,21.6 v54.9,20.9
  signal 0.35: v38.9,39.1 38.9,38.6
IOCARD  (via drill 0.35)
  Top 0.3: 34.3,13.44 CN2.SW2 36.32,13.42 R18.1 36.4,15.2 v36.3,15.3 | U1.46 30.75,20.65 30.75,20.05 v32.3,18.5
  signal 0.3: v32.3,18.5 35.5,15.3 v36.3,15.3
IOFAN1
  Top 0.3: U1.55 36.85,28.75 37.6,29.5 46.27,29.5 U3.2
IOFAN2
  Top 0.3: U1.50 42.65,26.25 45.3,28.9 46.27,28.9 U3.3
IOG11  (via drill 0.35)
  Top 0.3: U1.41 28.25,25.85 v29.4,27 | v47.2,56.9 v47.2,36.3
  signal 0.3: v29.4,27 37.9,27 v47.2,36.3 | J2.3 43.5,70.04 43.5,60.6 47.1,57 v47.2,56.9
IOG11N  (via drill 0.35)
  Top 0.3: U1.23 25.35,30.25 25.75,30.25 v26.8,31.3 | v42.2,61 41.6,60.4 v41.6,36.3
  signal 0.3: v26.8,31.3 28.7,33.2 38.5,33.2 v41.6,36.3 | J2.4 42.2,68.66 v42.2,61
IOG12  (via drill 0.35)
  Top 0.3: U1.42 28.75,25.15 v29.4,25.8 | v48.6,52.7 v48.6,36.3
  signal 0.3: v29.4,25.8 38.1,25.8 v48.6,36.3 | J2.5 41.1,69.9 41.1,60.2 v48.6,52.7
IOG12N  (via drill 0.35)
  Top 0.3: U1.26 25.95,28.75 v28.5,31.3 | v42.6,56.9 43,56.5 v43,36.3
  signal 0.3: v28.5,31.3 29.3,32.1 38.8,32.1 v43,36.3 | J2.6 39.73,59.77 v42.6,56.9
IOG83  (via drill 0.35)
  Top 0.3: U1.39 27.25,26.95 v27.3,27 | v46.3,61 45.8,60.5 v45.8,36.3
  signal 0.3: v27.3,27 28.1,27.8 37.3,27.8 v45.8,36.3 | J2.1 46.3,69.78 v46.3,61
IOG83N  (via drill 0.35)
  Top 0.3: U1.27 26.35,28.25 26.95,28.25 v30,31.3 | v44.8,61 44.4,60.6 v44.4,36.3
  signal 0.3: v30,31.3 39.4,31.3 v44.4,36.3 | J2.2 v44.8,61
IOLED1  (via drill 0.35)
  Top 0.3: U1.40 27.75,22.15 v27.8,22.1 | v15.4,21.3 10.9,21.3 10.2,20.6 R9.2
  signal 0.3: v27.8,22.1 24.8,19.1 19.9,19.1 17.7,21.3 v15.4,21.3
IOLED2  (via drill 0.35)
  Top 0.3: U1.56 32.05,29.25 v32,29.2 | v14.4,29.2 14.3,29.1 14.3,25 12.9,23.6 12.8,23.5 9.4,23.5 6.5,20.6 R11.2
  signal 0.3: v32,29.2 v14.4,29.2
IOLED3  (via drill 0.35)
  Top 0.3: U1.57 32.55,29.75 v32,30.3 | v16.9,30.3 15.4,28.8 15.4,24.4 13.5,22.5 9.8,22.5 8.3,21 R12.2
  signal 0.3: v32,30.3 v16.9,30.3
IOSPKR
  Top 0.3: U1.58 36.95,30.25 37,30.2 46.27,30.2 U3.1
IOSWITCH1
  Top 0.3: U1.25 18.95,29.25 17.6,27.9 17.6,19 16.4,17.8 R13.2
  Top 0.35: R13.2 14,14.5 13.3,13.8 13.3,6.99 SW1.1
N$1
  Top 0.35: U3.14 54.88,28.88 55.9,29.9 55.9,49.9 56.9,50.9 64,50.9 66.5,53.4 66.5,54.66 FAN4.2 FAN2.2
N$2
  Top 0.35: USB1.P3 41.84,8.24 43,9.4 R17.2
N$3
  Top 0.3: U1.5 29.75,36.35 31.5,38.1 X1.3
N$4
  Top 0.35: USB1.P2 41.19,8.31 41,8.5 R16.2
N$5  (via drill 2.5)
  other vias: 71.5,3.5
N$6
  Top 0.35: FAN1.2 FAN3.2 66.46,60.36 65.2,59.1 65.2,53.6 63.5,51.9 55.9,51.9 54.7,50.7 54.7,30.4 53.83,29.52 U3.15
N$7  (via drill 2.5)  (2 unrouted)
  other vias: 3.5,22.5 3.5,39 17.5,70.5
N$8
  Top 0.5: D2.C 53.1,13.7 53.6,14.2 53.6,17.3 51.95,18.95 U6.3 51.95,20.75 51.7,21 50.3,21 50.05,20.75 U6.1
N$9
  Top 0.3: R15.1 33.3,48.8 33.7,48.4 33.7,48 34.1,47.6 34.75,47.6 U4.2
N$10
  Top 0.35: U5.4 63.45,14.25 R19.1
N$11
  Top 0.35: U5.1 61.55,10.35 62.5,11.3 62.5,12.8 61.8,13.5 R19.2 61.8,15 60.6,16.2 R20.1
N$12
  Top 0.3: U1.22 20.45,30.75 19.8,31.4 16.8,31.4 14.4,33.8 14.4,39.1 15.5,40.2 CN1.2
N$13
  Top 0.35: U5.3 64.5,9.5 CN3.1
N$14  (via drill 2.5)
  other vias: 71.5,70.5
N$15
  Top 0.35: LED1.A 3.73,5.83 4.8,6.9 6.4,6.9 7.8,8.3 7.8,12.7 10.2,15.1 R9.1
N$16
  Top 0.35: R11.1 4,17.8 2,15.8 2,11.23 LED2.A
N$17
  Top 0.35: R12.1 8.3,17.3 6.9,15.9 4.8,15.9 3.7,14.8 3.7,13.97 LED3.A
N$18
  Top 0.35: U2.1 62.05,18.1 R21.1
N$19  (via drill 2.5)
  other vias: 62,3.6
N$21  (via drill 2.5)
  other vias: 43.5,22.7
N$29
  Top 0.3: U1.31 20.65,26.25 19.1,24.7 C6.1
N$39
  Top 0.3: U1.47 31.25,22.15 31.25,20.85 32.2,19.9 36.5,19.9 36.8,20.2 C5.1
NRST  (via drill 0.35)
  Top 0.3: U1.7 28.75,36.95 v29.6,37.8
  Top 0.35: SW2.4 v57,3.6 SW2.2 57,7.7 56.7,8 C15.1 R5.1
  signal 0.3: v57,3.6 57.6,4.2 57.6,16.2 53,20.8 53,36.2 51.5,37.7 51.4,37.8 v29.6,37.8
  signal 0.35: CN6.2 15.73,3.47 17.2,2 35.6,2 37.1,3.5 51.7,3.5 53,2.2 55.6,2.2 v57,3.6
RX  (via drill 0.45)
  Top 0.3: U1.52 40.15,27.25 41.4,28.5 v42.6,28.5
SDCS
  Top 0.3: U1.37 26.25,20.55 26.25,18.65 28.4,16.5 28.4,10.8 30.5,8.7 30.5,3.65 CN2.2
SPIMISO
  Top 0.3: U1.35 25.25,17.85 27.2,15.9 27.2,9 25.02,6.83 25.02,6.74 | CN2.7 25.02,6.74 | 25.02,6.74 24.98,6.78 18.32,6.78 CN6.3
SPIMOSI  (via drill 0.35)
  Top 0.3: U1.36 25.75,19.75 25.75,18.25 27.8,16.2 27.8,9.9 v28.4,9.3 29.4,8.3 29.4,3.65 CN2.3
  signal 0.3: v28.4,9.3 18.3,9.3 CN6.5
SPISCK  (via drill 0.35)
  Top 0.3: U1.34 24.75,17.55 26.2,16.1 26.6,15.7 26.6,10 v24.6,8 19,8 17,8 CN6.4 | 27.3,3.69 CN2.5 27.23,7.38 v27.2,7.4
  signal 0.3: v27.2,7.4 25.2,7.4 v24.6,8
SPKR
  Top 0.3: 53.6,51.2 56,53.6 NY1.P2
  Top 0.35: U3.16 52.67,30.18 53.6,31.1 53.6,51.2 | D1.A 58.31,59.62 NY1.P2
TX  (via drill 0.45)
  Top 0.3: U1.51 41.25,26.75 v41.8,27.3
USBDM
  Top 0.3: U1.44 29.75,18.75 32,16.5 40.3,16.5 42.2,14.6 42.2,13.8 41,12.6 R16.1
USBDP
  Top 0.3: U1.45 30.25,19.05 32.2,17.1 40.8,17.1 43,14.9 R17.1
VBUS  (via drill 0.35, 0.45)
  Top 0.3: USB1.P1 40.54,7.16 v39.8,7.9 | 50.06,13.66 D2.A 50.1,14.3 50.5,14.7 51.5,14.7 51.9,15.1 C29.1
  Top 0.35: 50.06,13.66 48.84,13.66 v48.8,13.7
  signal 0.3: v39.8,7.9 39.8,10.4 43.3,13.9 44.6,13.9 48.6,13.9 v48.8,13.7
VCC  (via drill 0.35, 1)
  Top 0.3: U1.19 19.15,32.25 v18.1,33.3 | U1.64 32.05,33.25 31.75,33.55 U1.1 31.75,36.35 32.1,36.7 | U1.48 31.75,21.65 32.3,21.1 v33.7,21.1 C22.1 | U1.32 21.35,25.75 21,25.4 v21,24.6 C20.1 | 32.1,36.7 33.5,38.1 C19.1 | v33,35.9 32.9,35.9 32.1,36.7 | 11.8,10.57 SW1.3
  Top 0.35: C18.1 C19.1 | X1.4 37.9,41.1 38.35,41.55 | 38.35,41.55 C9.2 | CN2.SW1 34.32,9.18 v35.1,8.4 C16.1 | v39,41 38.9,41 38.35,41.55 | R5.2 58.3,11.7 | 58.3,11.7 C28.1 | v59.5,11.7 58.3,11.7 | SW3.1 53.6,1.7 v53.6,3.6 53.6,5.5 SW3.3 | C32.1 v50,36.3 | C7.1 v49.2,58.9 | C34.1 v18.8,63.4 | C35.1 v34.1,68.6 | C26.1 v49.3,68.6 | L1.1 C21.1 15.8,34 16.5,33.3 v18.1,33.3 | FAN2.3 60.69,57.6 NY1.P1 60.51,57.42 D1.C | C30.1 12.1,14.7 11.8,14.4 11.8,10.57
  Top 0.5: CN2.4 28.33,4.88 v28.3,4.9 | C2.1 68.2,26.5 C3.1 68.2,32.1 VREG1.3 | U6.5 50.05,21.8 C36.1 v46.7,21.8 | C27.1 C37.1 v60.3,65.4
  Top 1.5: v66,32.9 69,32.9 VREG1.3
  other vias: 70.5,20.5
  pour power (isolate 0.35): -0.9,-0.8 77.5,-0.8 77.5,64 72,64.1 72,74 -0.9,74.1
VCCA  (via drill 0.35)  (1 unrouted)
  Top 0.3: C23.1 22.7,38.1 23.2,37.6 23.2,34.4 24.1,33.5 25.5,33.5 25.75,33.75 U1.13 25.75,36.45 v26.3,37
  Top 0.35: C23.1 C24.1 C4.1 L1.2 | U4.1 35.15,49.35 35.8,50 38.5,50 39,49.5 C31.1 | v60.7,6.2 C39.1 60.7,11.7 61.1,12.1 U5.5 | U2.6 62.05,21.8 C25.1
  Top 0.5: v55.4,65.4 55.4,63.9 C33.1 | v40.4,48.9 39.1,48.9 C31.1 | C25.1 60,22.8 | 60,22.8 C41.1 | v58.6,22.7 59.9,22.7 60,22.8 | C42.1 v50,47.1
  signal 0.5: v26.3,37 v26.3,37.7 26.3,44.6 29.8,48.1 40.4,48.1 | 40.4,48.1 50.2,48.1 | 50.2,48.1 50.4,48.1 | 50.4,48.1 55.4,53.1 v55.4,65.4 55.4,68.06 J1.6 | v40.4,48.9 40.4,48.1 | 50.4,48.1 52.4,48.1 60,40.5 60,17.1 61,16.1 61,6.5 v60.7,6.2 | v50,47.1 50,47.9 50.2,48.1
VCCM
  Top 0.35: C44.1 63.1,68.73 | R14.1 66,20.5 63.95,20.5 U2.4
  Top 0.5: C1.1 62.1,29.2 62,29.1
  Top 0.75: R14.1 66,21.7
  Top 1.5: 62,44.6 62,43 62,42.1 62,29.1 62,24.9 63.3,23.6 65.2,23.6 66,22.8 66,21.7 | 62,44.6 69,51.6 FAN4.1 | VREG1.1 61.85,44.45 62,44.6
  Top 1.75: J1.4 J1.2 63.1,68.73 66.87,68.73 69,66.6 FAN1.1 FAN3.1 FAN2.1 FAN4.1
VIN  (via drill 1)
  Top 0.35: R14.2 66,19.5 63.95,19.5 U2.3
  Top 0.5: 68,14.6 68.1,14.7
  Top 0.75: R14.2 66,18.4
  Top 1.5: 68.1,15.9 68.1,14.7 68.1,8.02 68.1,7 67.02,5.92 CN3.3 | 68.1,15.9 68.1,16.3 68.1,18 v70.5,18 | 66,18.4 66,18 68.1,15.9

### Text on the board
Bottom: JAW 2014-09
tPlace: 3V | F | 12V | x | + | - | D | C | T:G | T:Sync | GPI1CTL Rev. 1 | www.791rl.com | JAW 2014-09 | Pb | T:BT0 | T:Rx | T:Tx | T:V3 | T:V12 | T:G | T:Vu | BT0 | RST | + | -
tNames: X1
bStop: JAW 2014-09